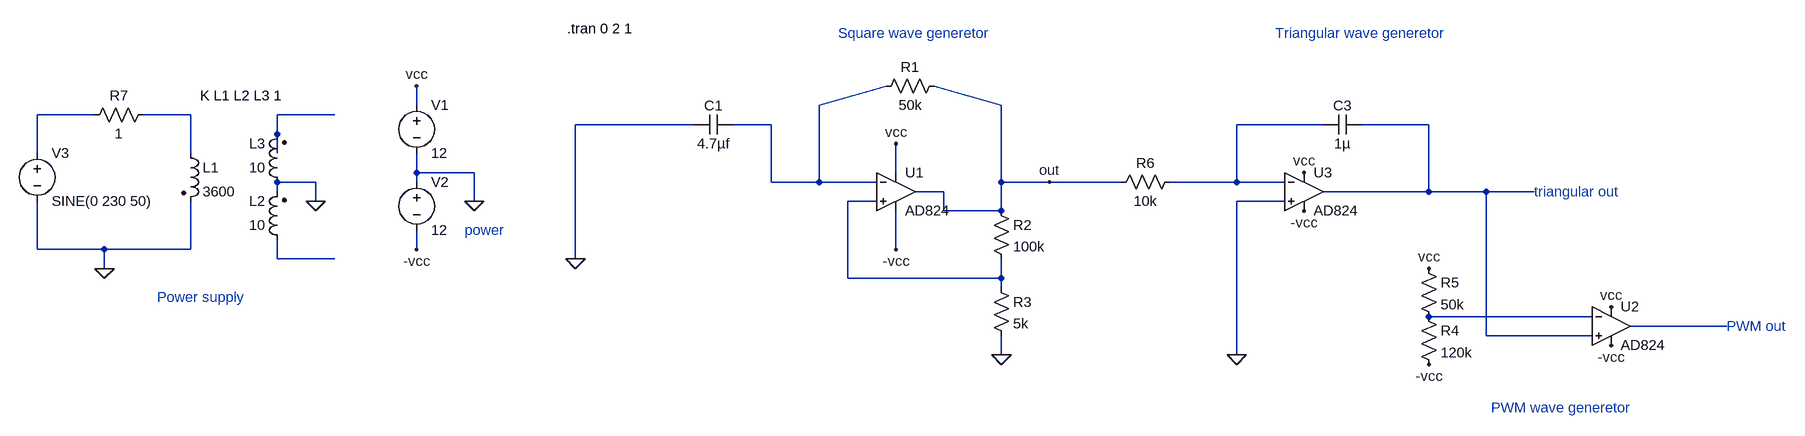
[diagram p0: schematic Funtion Generator - Basic.asc]
Funtion Generator - Basic.asc, the LTspice schematic file:
Version 4
SHEET 1 1916 884
WIRE -752 0 -752 -32
WIRE 32 0 144 -32
WIRE 336 0 224 -32
WIRE -1440 16 -1536 16
WIRE -1280 16 -1360 16
WIRE -1040 16 -1136 16
WIRE -176 32 -384 32
WIRE -48 32 -112 32
WIRE 944 32 800 32
WIRE 1120 32 1008 32
WIRE -1136 48 -1136 16
WIRE -1536 80 -1536 16
WIRE -1280 80 -1280 16
WIRE -1136 80 -1136 48
WIRE -752 112 -752 80
WIRE -656 112 -752 112
WIRE 160 112 160 64
WIRE -1072 128 -1136 128
WIRE -752 128 -752 112
WIRE -48 128 -48 32
WIRE 32 128 32 0
WIRE 32 128 -48 128
WIRE 128 128 32 128
WIRE 336 128 336 0
WIRE 416 128 336 128
WIRE 608 128 416 128
WIRE 800 128 800 32
WIRE 800 128 688 128
WIRE 880 128 800 128
WIRE -1136 144 -1136 128
WIRE 240 144 192 144
WIRE 1120 144 1120 32
WIRE 1120 144 944 144
WIRE 1216 144 1120 144
WIRE 1296 144 1216 144
WIRE -1072 160 -1072 128
WIRE -656 160 -656 112
WIRE 128 160 80 160
WIRE 880 160 800 160
WIRE 240 176 240 144
WIRE 336 176 336 128
WIRE 336 176 240 176
WIRE -1536 240 -1536 160
WIRE -1424 240 -1536 240
WIRE -1280 240 -1280 160
WIRE -1280 240 -1424 240
WIRE -752 240 -752 208
WIRE 160 240 160 176
WIRE -1136 256 -1136 224
WIRE -1040 256 -1136 256
WIRE -384 256 -384 32
WIRE -1424 272 -1424 240
WIRE 80 288 80 160
WIRE 336 288 336 256
WIRE 336 288 80 288
WIRE 336 304 336 288
WIRE 1392 352 1120 352
WIRE 1808 368 1456 368
WIRE 1216 384 1216 144
WIRE 1392 384 1216 384
WIRE 336 416 336 384
WIRE 800 416 800 160
FLAG 416 128 out
FLAG 160 64 vcc
FLAG 160 240 -vcc
FLAG -752 -32 vcc
FLAG -752 240 -vcc
FLAG -656 160 0
FLAG -384 256 0
FLAG 336 416 0
FLAG 912 112 vcc
FLAG 912 176 -vcc
FLAG 800 416 0
FLAG 1424 336 vcc
FLAG 1424 400 -vcc
FLAG 1120 272 vcc
FLAG 1120 432 -vcc
FLAG -1424 272 0
FLAG -1072 160 0
SYMBOL OpAmps\\AD824 160 80 R0
SYMATTR InstName U1
SYMBOL res 240 -48 R90
WINDOW 0 0 56 VBottom 2
WINDOW 3 32 56 VTop 2
SYMATTR InstName R1
SYMATTR Value 50k
SYMBOL cap -176 48 R270
WINDOW 0 32 32 VTop 2
WINDOW 3 0 32 VBottom 2
SYMATTR InstName C1
SYMATTR Value 4.7µf
SYMBOL res 320 160 R0
SYMATTR InstName R2
SYMATTR Value 100k
SYMBOL res 320 288 R0
SYMATTR InstName R3
SYMATTR Value 5k
SYMBOL voltage -752 -16 R0
WINDOW 123 0 0 Left 0
WINDOW 39 0 0 Left 0
SYMATTR InstName V1
SYMATTR Value 12
SYMBOL voltage -752 112 R0
WINDOW 123 0 0 Left 0
WINDOW 39 0 0 Left 0
SYMATTR InstName V2
SYMATTR Value 12
SYMBOL OpAmps\\AD824 912 80 R0
SYMATTR InstName U3
SYMBOL res 704 112 R90
WINDOW 0 0 56 VBottom 2
WINDOW 3 32 56 VTop 2
SYMATTR InstName R6
SYMATTR Value 10k
SYMBOL cap 1008 16 R90
WINDOW 0 0 32 VBottom 2
WINDOW 3 32 32 VTop 2
SYMATTR InstName C3
SYMATTR Value 1µ
SYMBOL OpAmps\\AD824 1424 304 R0
SYMATTR InstName U2
SYMBOL res 1104 336 R0
SYMATTR InstName R4
SYMATTR Value 120k
SYMBOL res 1104 256 R0
SYMATTR InstName R5
SYMATTR Value 50k
SYMBOL voltage -1536 64 R0
WINDOW 123 0 0 Left 0
WINDOW 39 0 0 Left 0
SYMATTR InstName V3
SYMATTR Value SINE(0 230 50)
SYMBOL ind2 -1296 64 R0
SYMATTR InstName L1
SYMATTR Value 3600
SYMATTR Type ind
SYMBOL ind2 -1120 240 R180
WINDOW 0 36 80 Left 2
WINDOW 3 36 40 Left 2
SYMATTR InstName L2
SYMATTR Value 10
SYMATTR Type ind
SYMBOL res -1344 0 R90
WINDOW 0 0 56 VBottom 2
WINDOW 3 32 56 VTop 2
SYMATTR InstName R7
SYMATTR Value 1
SYMBOL ind2 -1120 144 R180
WINDOW 0 36 80 Left 2
WINDOW 3 36 40 Left 2
SYMATTR InstName L3
SYMATTR Value 10
SYMATTR Type ind
TEXT -398 -128 Left 2 !.tran 0 2 1
TEXT 64 -120 Left 2 ;Square wave generetor
TEXT -672 208 Left 2 ;power
TEXT 1296 144 Left 2 ;triangular out
TEXT 864 -120 Left 2 ;Triangular wave generetor
TEXT 1808 368 Left 2 ;PWM out
TEXT 1224 504 Left 2 ;PWM wave generetor
TEXT -1264 -16 Left 2 !K L1 L2 L3 1
TEXT -1336 320 Left 2 ;Power supply

The netlist it stands for:
* Funtion Generator - Basic.asc
XU1 N007 N001 vcc -vcc out AD824  ; pins In+ In- V+ V- OUT
R1 out N001 50k
C1 0 N001 4.7µf
R2 out N007 100k
R3 N007 0 5k
V1 vcc 0 12
V2 0 -vcc 12
XU3 0 N005 vcc -vcc N006 AD824  ; pins In+ In- V+ V- OUT
R6 N005 out 10k
C3 N006 N005 1µ
XU2 N006 N009 vcc -vcc N010 AD824  ; pins In+ In- V+ V- OUT
R4 N009 -vcc 120k
R5 vcc N009 50k
V3 N002 0 SINE(0 230 50)
L1 N003 0 3600
L2 N008 0 10
R7 N003 N002 1
L3 0 N004 10
.tran 0 2 1
* Square wave generetor
* power
* triangular out
* Triangular wave generetor
* PWM out
* PWM wave generetor
K L1 L2 L3 1
* Power supply
.backanno
.end